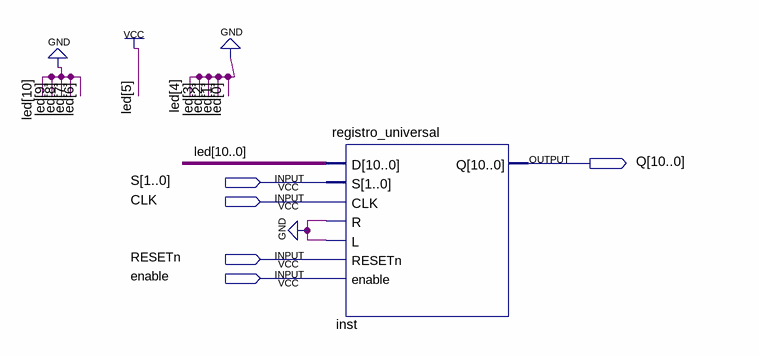
[diagram p0: schematic sheet]
// Quartus schematic ayuda.bdf as structural Verilog: 1 symbols, 5 pins
module ayuda (
  input  [1:0] S,
  input  CLK,
  input  RESETn,
  input  enable,
  output [10:0] Q
);

  registro_universal inst (
    .D(11'b00000100000), .S(S), .CLK(CLK), .R(1'b0), .L(1'b0), .RESETn(RESETn), .enable(enable), .Q(Q));
endmodule
